# EasyEDA Pro project ProDoc_PCB_Shield_2026-03-18.epro

# Board PCB1
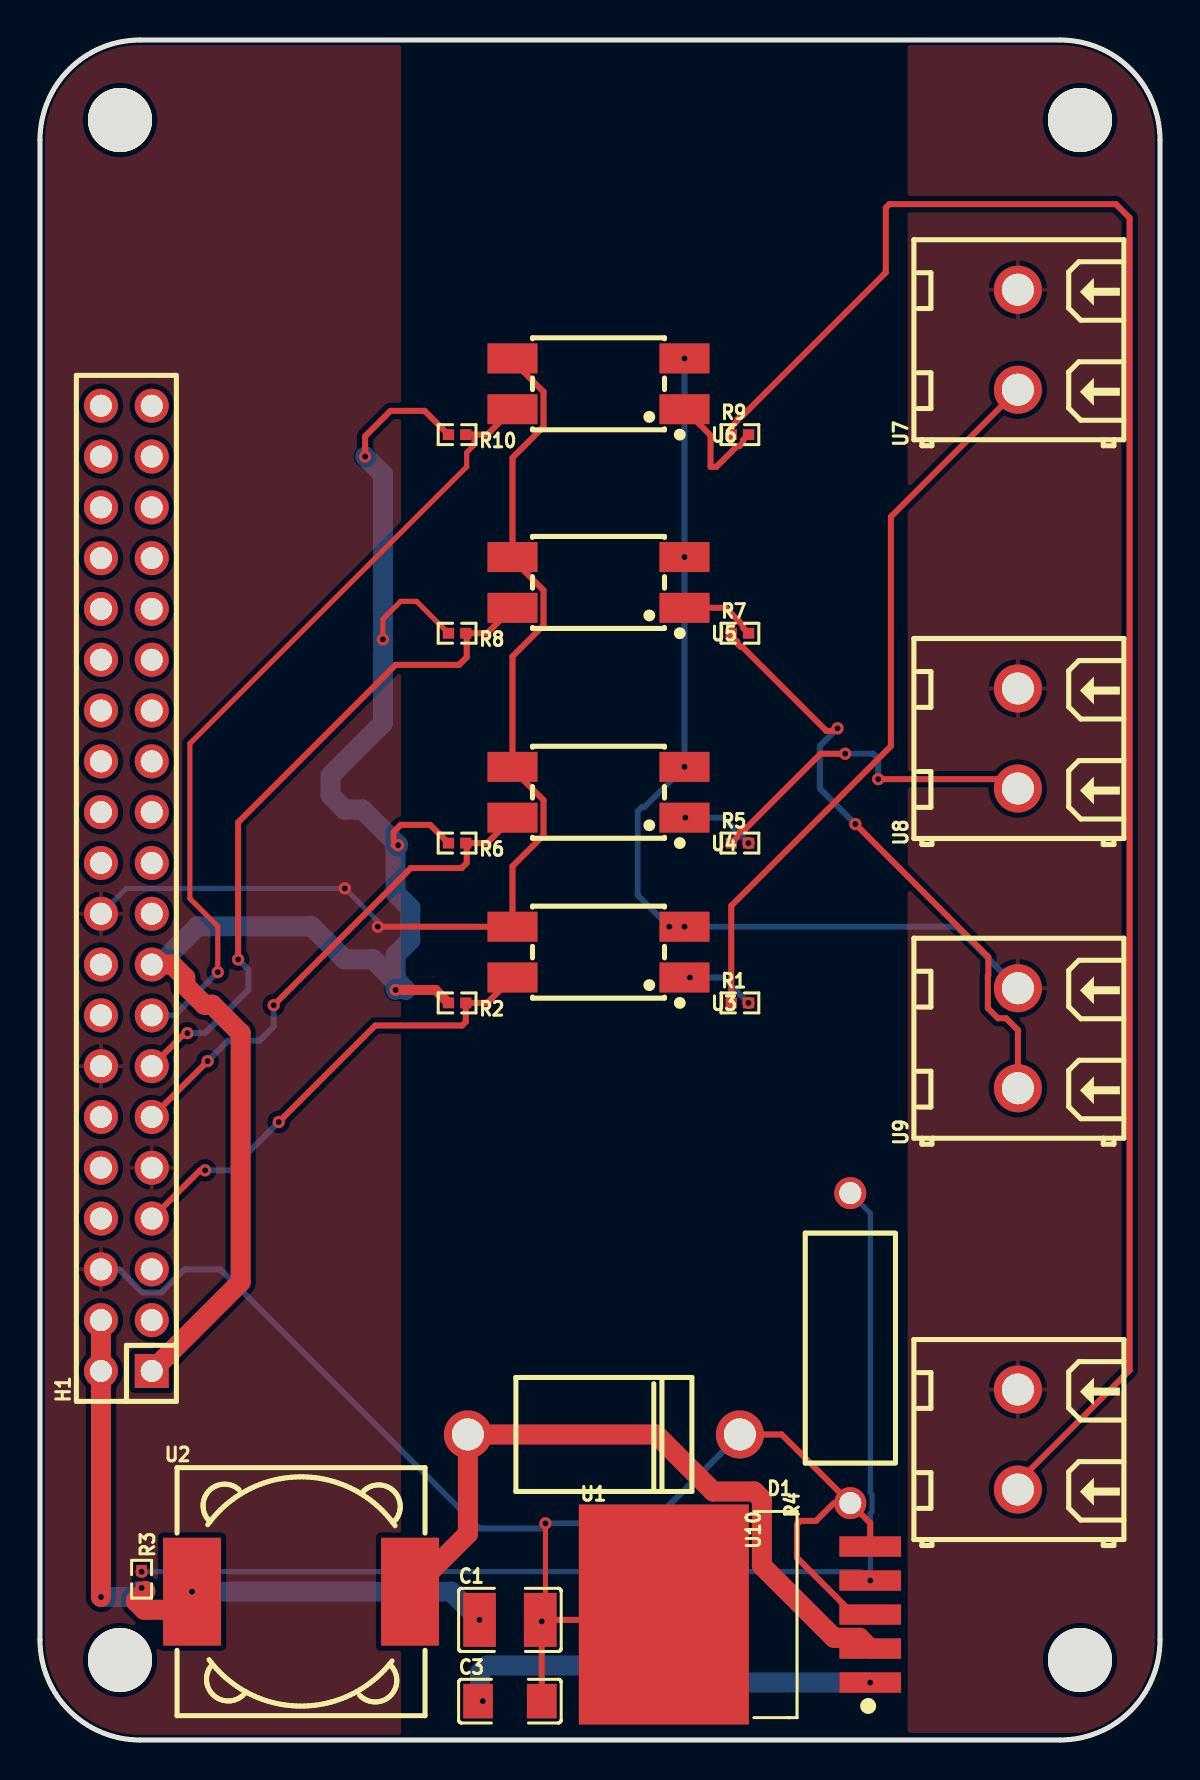
[diagram p0: board, top side]
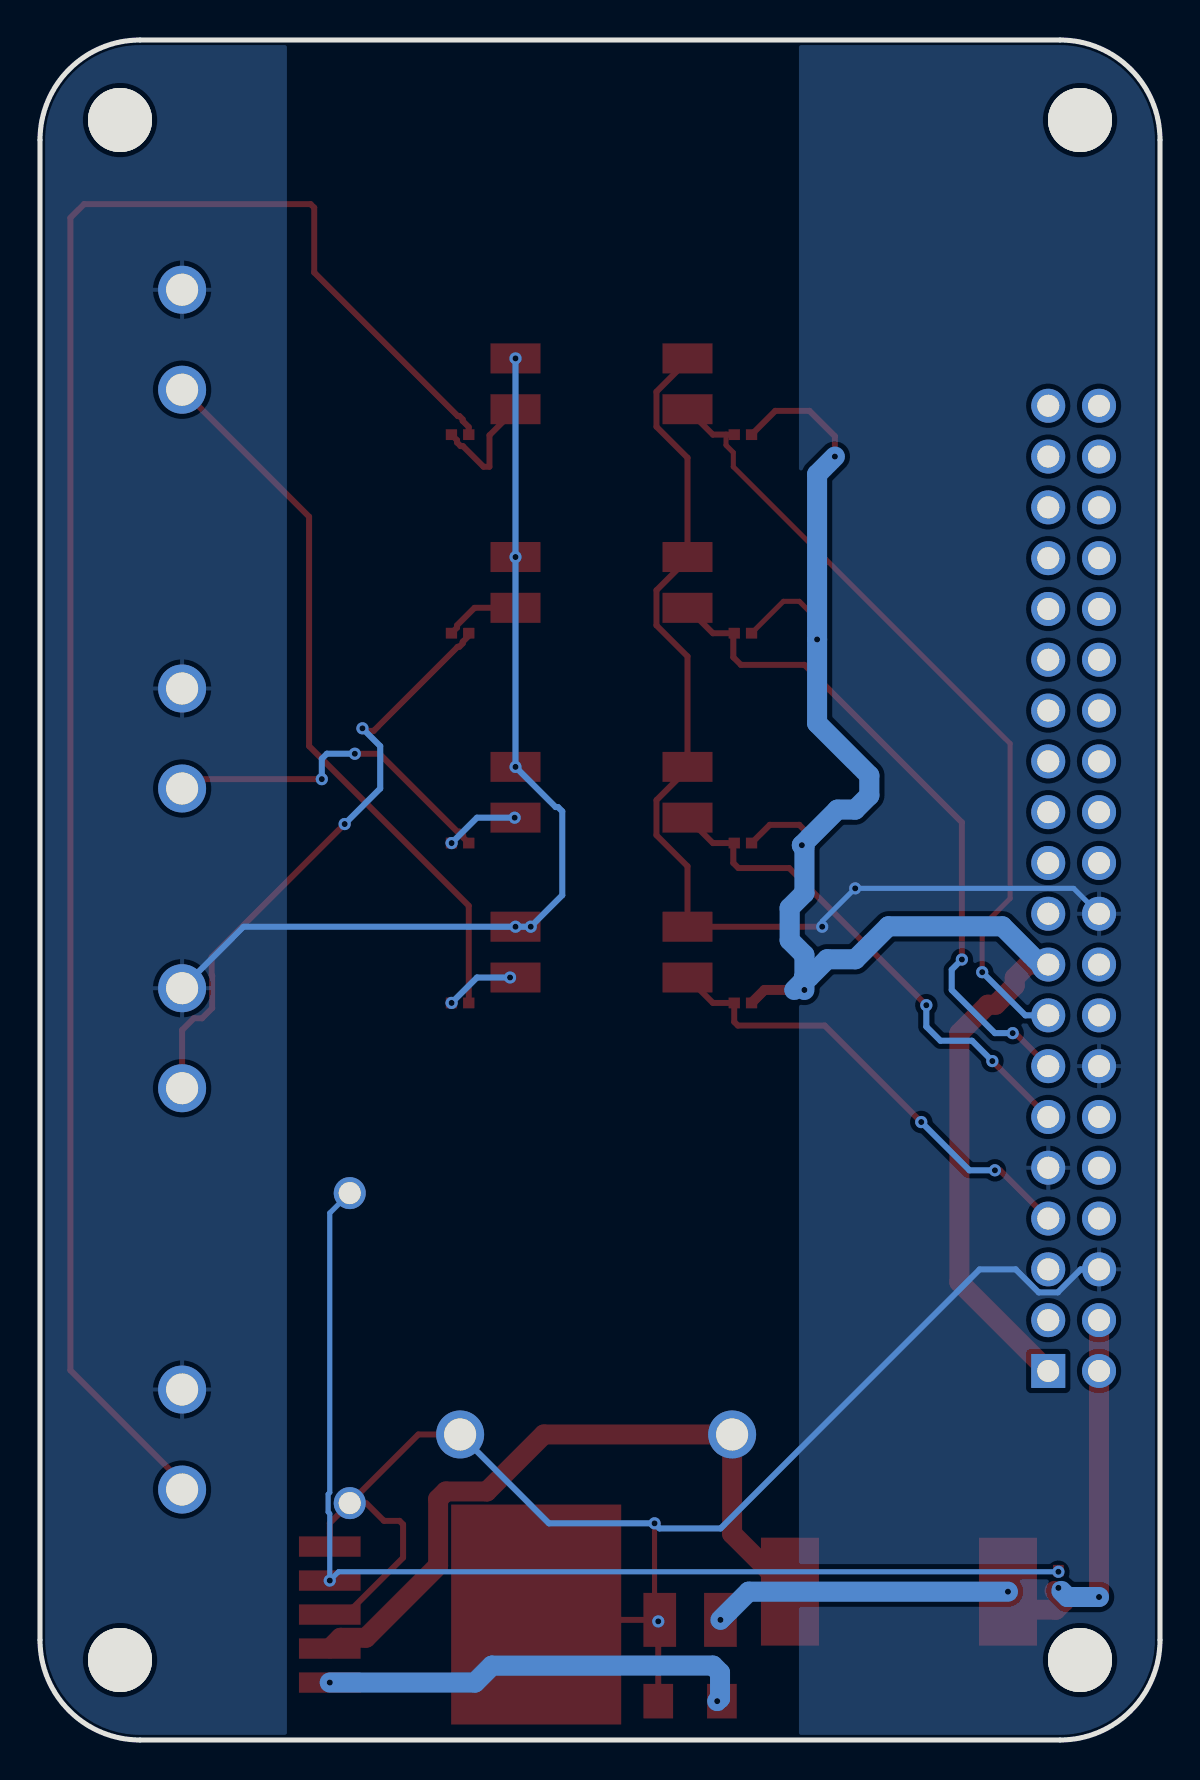
[diagram p1: board, bottom side, seen from below]

Outline 56 x 85 mm; copper layers: Top Layer, Bottom Layer. Coordinates in mm from the lower left corner of the outline.
Outline path: 0,80 0,5 arc(1.46,1.46) 5,0 51,0 arc(54.54,1.46) 56,5 56,80 arc(54.54,83.54) 51,85 5,85 arc(1.46,83.54) 0,80
Stack: Top Layer 0.035mm / Dielectric1 1.51mm FR4 er 4.5 / Bottom Layer 0.035mm

## Design rules (mm)
template: JLCPCB Capability(Two Layers Board)
spacing copperThickness1oz (default): track to track 0.102, other pairs 0.152 to 0.3
spacing copperThickness2oz: track to track 0.203, other pairs 0.152 to 0.3
track width copperThickness1oz (default): min 0.127, default 0.254, max 2.54
track width copperThickness2oz: min 0.203, default 0.254, max 2.54
differential pair differentialPair (default): width min 0.127, default 0.254, max 2.54; gap min 0.152, default 0.152
via viaSize (default): diameter min 0.5, default 0.61, max 10; hole min 0.3, default 0.305, max 6.3

## Placement (name value [footprint] x y rotation side)
C1  220uF  [C1210]  23.49 6.01 0 top
C3  100uF  [C1206]  23.49 1.94 0 top
D1  1N5822  [DO-201AD_BD5.3-L8.4-P12.50-D1.4-RD]  28.19 15.28 180 top
H1  2.54-2*20P母长PC104  [HDR-TH_40P-P2.54-V-F-R2-C20-S2.54-2]  4.32 42.58 90 top
NOREF  -  [Pad_e555]  4 81 0 top
NOREF#2  -  [Pad_e557]  52 81 0 top
NOREF#3  -  [Pad_e554]  4 4 0 top
NOREF#4  -  [Pad_e556]  52 4 0 top
R1  470Ω  [R0402]  35 36.85 0 top
R2  10kΩ  [R0402]  20.86 36.85 180 top
R3  10kΩ  [R0402]  5.08 8.04 270 top
R4  3.3kΩ  [RES-TH_BD4.5-L11.5-P15.50-D0.8]  40.51 19.59 90 top
R5  470Ω  [R0402]  35 44.85 0 top
R6  10kΩ  [R0402]  20.86 44.85 180 top
R7  470Ω  [R0402]  35 55.34 0 top
R8  10kΩ  [R0402]  20.86 55.34 180 top
R9  470Ω  [R0402]  35 65.27 0 top
R10  10kΩ  [R0402]  20.86 65.27 180 top
U1  LM2596S-ADJ(UMW)  [TO-263-5_L10.2-W8.9-P1.70-BR]  36.35 6.27 0 top
U2  100uH  [IND-SMD_L12.3-W12.3]  13.05 7.42 0 top
U3  PC817C  [OPTO-SMD-4_L4.6-W6.5-P2.54-LS10.3-TL]  27.92 39.39 180 top
U4  PC817C  [OPTO-SMD-4_L4.6-W6.5-P2.54-LS10.3-TL]  27.92 47.39 180 top
U5  PC817C  [OPTO-SMD-4_L4.6-W6.5-P2.54-LS10.3-TL]  27.92 57.88 180 top
U6  PC817C  [OPTO-SMD-4_L4.6-W6.5-P2.54-LS10.3-TL]  27.92 67.81 180 top
U7  KF128-5.0-2P  [CONN-TH_P5.00_KF128-5.0-2P]  48.89 70.01 90 top
U8  KF128-5.0-2P  [CONN-TH_P5.00_KF128-5.0-2P]  48.89 50.08 90 top
U9  KF128-5.0-2P  [CONN-TH_P5.00_KF128-5.0-2P]  48.89 35.09 90 top
U10  KF128-5.0-2P  [CONN-TH_P5.00_KF128-5.0-2P]  48.89 15.02 90 top

## Footprints (pads in the part's own frame, mm; a bottom-side part is the same pattern mirrored in y, then rotated)
C1206
  rect 1.485x1.728 smd: 1(-1.593,0) 2(1.593,0)
C1210
  rect 1.635x2.7 smd: 1(-1.518,0) 2(1.518,0)
CONN-TH_P5.00_KF128-5.0-2P
  round 2.4 hole 1.6: 1(-2.5,0) 2(2.5,0)
DO-201AD_BD5.3-L8.4-P12.50-D1.4-RD
  round 2.4 hole 1.6: 1(-6.8,0) 2(6.8,0)
HDR-TH_40P-P2.54-V-F-R2-C20-S2.54-2
  rect 1.7x1.7 hole 1.1: 1(-24.13,-1.27)
  round 1.7 hole 1.1: 2(-24.13,1.27) 3(-21.59,-1.27) 4(-21.59,1.27) 5(-19.05,-1.27) 6(-19.05,1.27) 7(-16.51,-1.27) 8(-16.51,1.27) 9(-13.97,-1.27) 10(-13.97,1.27) 11(-11.43,-1.27) 12(-11.43,1.27) 13(-8.89,-1.27) 14(-8.89,1.27) 15(-6.35,-1.27) 16(-6.35,1.27) 17(-3.81,-1.27) 18(-3.81,1.27) 19(-1.27,-1.27) 20(-1.27,1.27) 21(1.27,-1.27) 22(1.27,1.27) 23(3.81,-1.27) 24(3.81,1.27) 25(6.35,-1.27) 26(6.35,1.27) 27(8.89,-1.27) 28(8.89,1.27) 29(11.43,-1.27) 30(11.43,1.27) 31(13.97,-1.27) 32(13.97,1.27) 33(16.51,-1.27) 34(16.51,1.27) 35(19.05,-1.27) 36(19.05,1.27) 37(21.59,-1.27) 38(21.59,1.27) 39(24.13,-1.27) 40(24.13,1.27)
IND-SMD_L12.3-W12.3
  rect 2.9x5.4 smd: 1(-5.45,0) 2(5.45,0)
OPTO-SMD-4_L4.6-W6.5-P2.54-LS10.3-TL
  rect 2.5x1.5 smd: 1(-4.3,1.27) 2(-4.3,-1.27) 3(4.3,-1.27) 4(4.3,1.27)
Pad_e554
  round 3.2 hole 3.2: 1(0,0)
Pad_e555
  round 3.2 hole 3.2: 1(0,0)
Pad_e556
  round 3.2 hole 3.2: 1(0,0)
Pad_e557
  round 3.2 hole 3.2: 1(0,0)
R0402
  rect 0.566x0.54 smd: 1(-0.433,0) 2(0.433,0)
RES-TH_BD4.5-L11.5-P15.50-D0.8
  round 1.6 hole 1.1: 1(-7.75,0) 2(7.75,0)
TO-263-5_L10.2-W8.9-P1.70-BR
  rect 3.083x1.02 smd: 1(5.16,-3.4) 2(5.16,-1.7) 3(5.16,0) 4(5.16,1.7) 5(5.16,3.4)
  rect 8.5x11 smd: 6(-5.16,0)

## Nets
3V3_VCC: H1.1 H1.17 R2.2 R6.2 R8.2 R10.2
5V_CLEAN: C1.1 H1.2 H1.4 R3.2 U2.1
GND_CLEAN: C1.2 C3.2 D1.1 H1.6 H1.9 H1.14 H1.20 R4.1 U1.3 U1.5 U1.6 U3.3 U4.3 U5.3 U6.3
GND_DIRTY: U3.2 U4.2 U5.2 U6.2 U7.2 U8.2 U9.2 U10.2
VIN: C3.1 U1.1
GPIO4: H1.7 R2.1 U3.4
GPIO17: H1.11 R6.1 U4.4
GPIO22: H1.15 R10.1 U6.4
GPIO27: H1.13 R8.1 U5.4
$1N293: R1.2 U3.1
$1N340: R1.1 U7.1
$1N1294: D1.2 U1.2 U2.2
$1N1349: R3.1 R4.2 U1.4
$1N1584: R5.2 U4.1
$1N1588: R5.1 U8.1
$1N1965: R7.2 U5.1
$1N1967: R7.1 U9.1
$1N2149: R9.2 U6.1
$1N2151: R9.1 U10.1

Pads without a net: H1 3 5 8 10 12 16 18 19 21 22 23 24 25 26 27 28 29 30 31 32 33 34 35 36 37 38 39 40; NOREF 1; NOREF#2 1; NOREF#3 1; NOREF#4 1

## Via types
v1: diameter 0.61, hole 0.305, Top Layer to Bottom Layer, 36 vias

## Routing (per net, layer and track width the routed paths; a pad name or vN(x,y) marks a point on that pad's centre or on a via; arc(x,y) is an arc through that point)
3V3_VCC: length 88.1
  Top Layer w0.254: v1(17.14,55.03) 17.14,56.04 18.03,56.93 18.83,56.93 R8.2
  Top Layer w0.3: R6.2 19.51,45.76 18.03,45.76 17.68,45.4 17.68,44.74 ; R10.2 19.23,66.46 17.53,66.46 16.26,65.19 v1(16.26,64.17)
  Top Layer w0.5: v1(17.78,37.5) 19.77,37.5 R2.2
  Top Layer w1: 5.59,18.45 10.03,22.9 10.03,35.34 8.61,36.76 8.22,36.76 7.26,37.72 7.26,38.11 6.6,38.77 5.59,38.77
  Bottom Layer w1: 17.78,38.14 17.81,38.11 17.81,38.04 17.78,38.01 ; 17.78,38.14 17.78,39.25 18.52,39.99 18.52,41.61 17.78,42.34 17.78,44.61 v1(17.91,44.74) 16.13,46.52 15.24,46.52 14.53,47.23 14.53,48.23 17.14,50.84 v1(17.14,55.03) 17.14,63.28 v1(16.26,64.17) ; 17.78,38.14 17.54,38.14 16.64,39.04 15.23,39.04 13.58,40.68 7.88,40.68 6.1,38.9 ; 17.78,38.01 v1(17.78,37.5) ; 17.78,38.01 18.29,37.5
5V_CLEAN: length 34.9
  Top Layer w1: v1(3.05,7.15) H1.2 H1.4 ; 5.27,7.45 4.8,6.98 4.8,6.92 5.21,6.51 6.7,6.51 v1(7.6,7.42)
  Bottom Layer w1: v1(21.98,6.01) 20.57,7.42 v1(7.6,7.42) ; 4.93,7.45 4.62,7.15 v1(3.05,7.15)
  vias: v1(5.08,7.6)
GND_CLEAN: length 127.4
  Top Layer w0.254: v1(25.27,10.83) 25.27,6.27 C1.2
  Top Layer w0.3: U6.3 23.63,68.97 25.18,67.41 25.18,65.66 23.63,64.11 U5.3 23.63,59.04 25.18,57.48 25.18,55.73 23.63,54.18 23.63,48.54 25.18,46.99 25.18,45.24 23.63,43.69 U3.3 v1(16.89,40.66) ; 31.19,6.27 30.92,6.01 C1.2 v1(25.09,5.93) C3.2 ; 39.69,11.84 38.8,10.96 38.02,10.96 37.85,10.78 37.85,9.12 40.69,6.27 ; U1.5 41.51,10.85 R4.1 37.08,15.28 D1.1
  Bottom Layer w0.254: H1.20 4.32,42.58 v1(15.24,42.58) 16.89,40.93 v1(16.89,40.66)
  Bottom Layer w0.3: H1.6 3.96,23.53 5.11,22.38 6.07,22.38 7.22,23.53 9.02,23.53 21.97,10.58 25.02,10.58 v1(25.27,10.83) 30.55,10.83 D1.1
GND_DIRTY: length 48.8
  Bottom Layer w0.3: U9.2 45.82,40.66 v1(32.23,40.66) v1(31.46,40.66) 29.89,42.24 29.89,46.43 30.1,46.65 30.22,46.65 v1(32.23,48.66) v1(32.23,59.15) v1(32.23,69.08)
VIN: length 21.5
  Bottom Layer w1: v1(22.14,1.94) 22,2.08 22,3.37 22.35,3.72 33.4,3.72 34.25,2.87 v1(41.51,2.87)
GPIO4: length 23.6
  Top Layer w0.3: v1(8.26,28.48) 8,28.48 5.59,26.07 ; U3.4 22.36,36.85 21.29,36.85 21.29,35.9 21.11,35.72 16.76,35.72 v1(11.94,30.9)
  Bottom Layer w0.3: v1(8.26,28.48) 9.52,28.48 v1(11.94,30.9)
GPIO17: length 25.5
  Top Layer w0.3: v1(11.68,36.74) 18.54,43.6 21.08,43.6 21.34,43.85 21.34,44.8 21.29,44.85 22.36,44.85 U4.4 ; 5.59,31.15 v1(8.38,33.95)
  Bottom Layer w0.3: v1(8.38,33.95) 9.4,34.96 10.98,34.96 11.68,35.67 v1(11.68,36.74)
GPIO22: length 40.4
  Top Layer w0.254: 21.7,65.27 21.7,64.74 21.34,64.38 21.34,63.66 7.49,49.82 7.49,42.07 8.89,40.68 v1(8.89,38.39)
  Top Layer w0.3: U6.4 22.36,65.27 21.29,65.27
  Bottom Layer w0.3: v1(8.89,38.39) 6.73,36.23 5.59,36.23
GPIO27: length 33.9
  Top Layer w0.3: v1(9.91,39.03) 9.91,45.88 17.78,53.76 20.95,53.76 21.34,54.14 21.34,55.29 21.29,55.34 22.36,55.34 U5.4 ; 5.59,33.69 7.24,35.34 v1(7.37,35.34)
  Bottom Layer w0.3: v1(9.91,39.03) 10.41,38.52 10.41,37.5 8.26,35.34 v1(7.37,35.34)
$1N293: length 3.5
  Bottom Layer w0.3: v1(32.5,38.12) 34.15,38.12 v1(35.42,36.85)
$1N340: length 36.6
  Top Layer w0.3: U7.1 42.55,61.16 42.55,49.69 34.56,41.71 R1.1
$1N1294: length 35.6
  Top Layer w1: U2.2 21.39,10.31 D1.2 30.81,15.28 33.66,12.43 35.71,12.43 36.09,12.04 36.09,8.72 39.7,5.11 40.97,5.11 U1.2
$1N1349: length 56.5
  Bottom Layer w0.254: v1(5.08,8.41) 41.07,8.41 v1(41.51,7.97) 41.51,11.32 41.59,11.4 41.59,12.29 41.51,12.37 41.51,26.35 R4.2
$1N1584: length 3.7
  Bottom Layer w0.3: v1(35.42,44.85) 34.15,46.12 v1(32.27,46.12)
$1N1588: length 17.6
  Top Layer w0.3: R5.1 34.84,45.13 34.84,45.24 35.02,45.42 35.14,45.42 39.03,49.31 v1(40.26,49.31) ; v1(41.91,48.04) 48.43,48.04 U8.1
  Bottom Layer w0.3: v1(41.91,48.04) 41.91,49.06 41.66,49.31 v1(40.26,49.31)
$1N1965: length 3.8
  Top Layer w0.3: U5.1 34.27,56.61 35.15,55.73 35.15,55.62 R7.2
$1N1967: length 30.1
  Top Layer w0.3: 34.56,55.21 34.87,54.91 34.87,54.83 35.03,54.66 35.11,54.66 39.32,50.46 39.88,50.46 ; v1(40.77,45.8) 47.42,39.15 47.42,38.23 47.39,38.21 47.39,36.59 47.9,36.09 48.31,36.09 48.89,35.5 U9.1
  Bottom Layer w0.3: v1(40.77,45.8) 38.99,47.58 38.99,49.69 v1(39.88,50.58)
$1N2149: length 6
  Top Layer w0.3: U6.1 33.53,65.24 33.53,63.66 33.82,63.66 34.86,64.7 34.97,64.7 35.15,64.87 35.15,64.99 R9.2
$1N2151: length 92.7
  Top Layer w0.3: 48.9,12.9 54.48,18.49 54.48,76.11 53.79,76.79 42.47,76.79 42.29,76.61 42.29,73.38 35.11,66.2 35.03,66.2 34.86,66.03 34.86,65.95 34.56,65.65 R9.1

## Copper pours and planes (outline as drawn; the poured copper is in the pictures)
GND_CLEAN on Top Layer: 0.25,85.13 18.05,85.13 18.05,-0.14 0.25,-0.14
GND_CLEAN on Bottom Layer: 0.25,84.75 18.05,84.75 18.05,0 0.25,0
GND_DIRTY on Top Layer: 43.38,85 56,85 56,0.35 43.38,0.35
GND_DIRTY on Bottom Layer: 43.65,85 56,85 56,0.09 43.65,0.09
